# Altium schematic sheet LPF.SchDoc
size 209 x 297 mm; PageSetup: Record=PageOptions|CenterHorizontal=False|CenterVertical=False|PrintScale=1.00|XCorrection=0.00|YCorrection=0.00|PrintKind=0|BorderSize=5000000|LeftOffset=0|BottomOffset=0|Orientation=2|PaperLength=1000|PaperWidth=1000|Scale=100|PaperSource=15|PrintQuality=-3|MediaType=1|DitherType=10|PrintScaleMode=0|PaperKind=A3|PaperIndex=8; TitleBlock_02_DocumentDesignator: BCAD.123456.001 Э3; TitleBlock_07_SheetNumber: 5
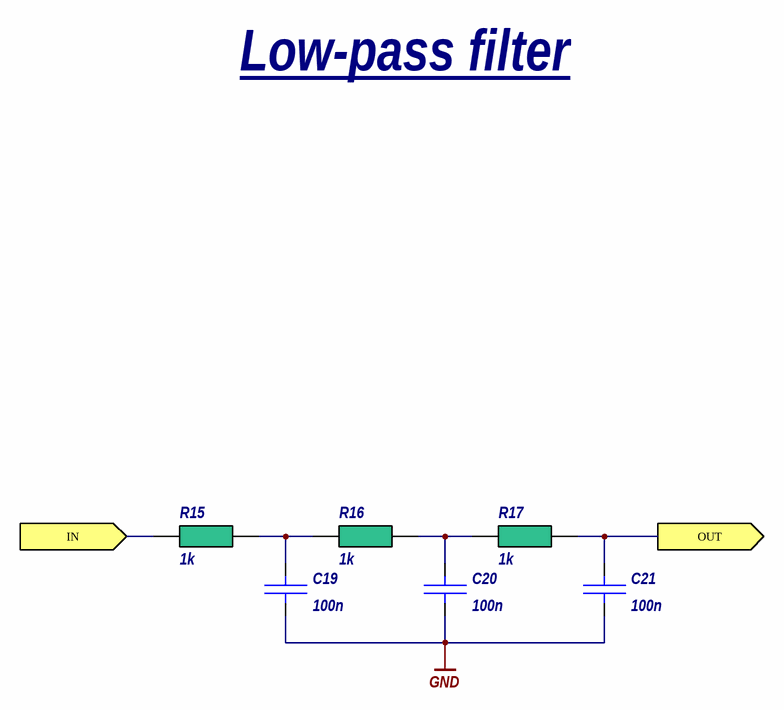
[diagram p0: LPF.SchDoc]

## Parts
C19  100n  [MLCC_0603]
C20  100n  [MLCC_0603]
C21  100n  [MLCC_0603]
R15  1k  [RC_0603]
R16  1k  [RC_0603]
R17  1k  [RC_0603]

## Ports
IN (in), OUT (out)

## Nets
GND: C19.1 C20.1 C21.1
IN: R15.1 ; port IN
OUT: C21.2 R17.2 ; port OUT
NetC19_2: C19.2 R15.2 R16.1
NetC20_2: C20.2 R16.2 R17.1

## Notes on the sheet
- Low-pass filter
- Подп. и дата
- Инв. № дубл.
- Взам. инв. №
- Инв. № подл.
- Изм.
- Лист
- № докум.
- Подп.
- Дата
- Копировал
- Формат А4

## Library data of the parts
C19-C21 = Capacitor nonpolar: Nonpolar capacitor, generic; BOM_manufacturer: YAGEO; BOM_value: CC0603KRX7R9BB104; BOM_type: Конденсатор; BOM_description: керам., чип 0603, X7R, 0.1мкФ ±10%, 50В; BOM_explicit: false; SCH_value: 100n
R15-R17 = Resistor: Fixed-value resistor, generic; BOM_manufacturer: YAGEO; BOM_value: RC0603FR-071KL; BOM_type: Резистор; BOM_description: чип 0603, 1кОм ±1%; BOM_explicit: false; SCH_value: 1k